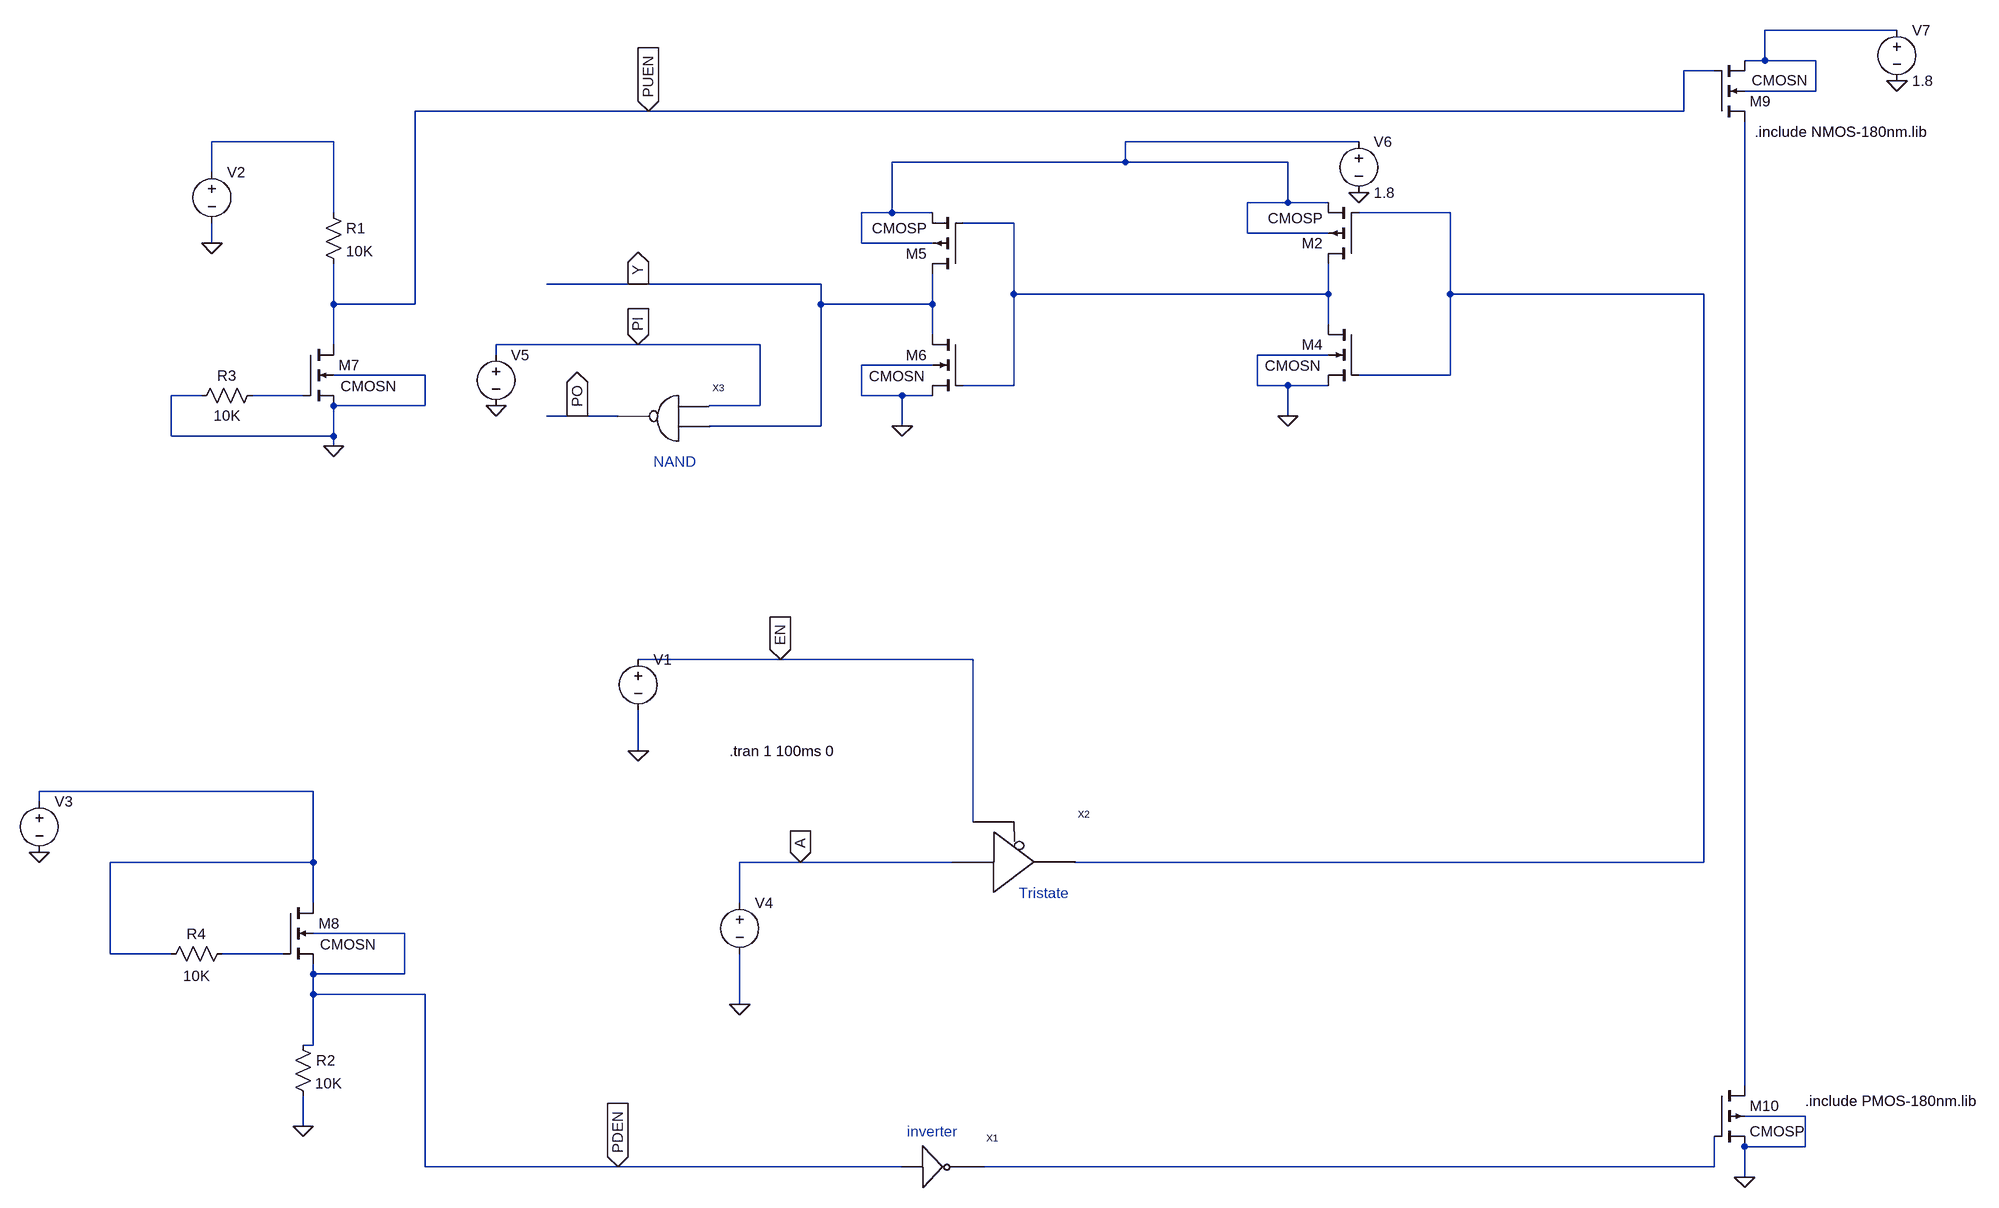
[diagram p0: schematic gpio.asc]
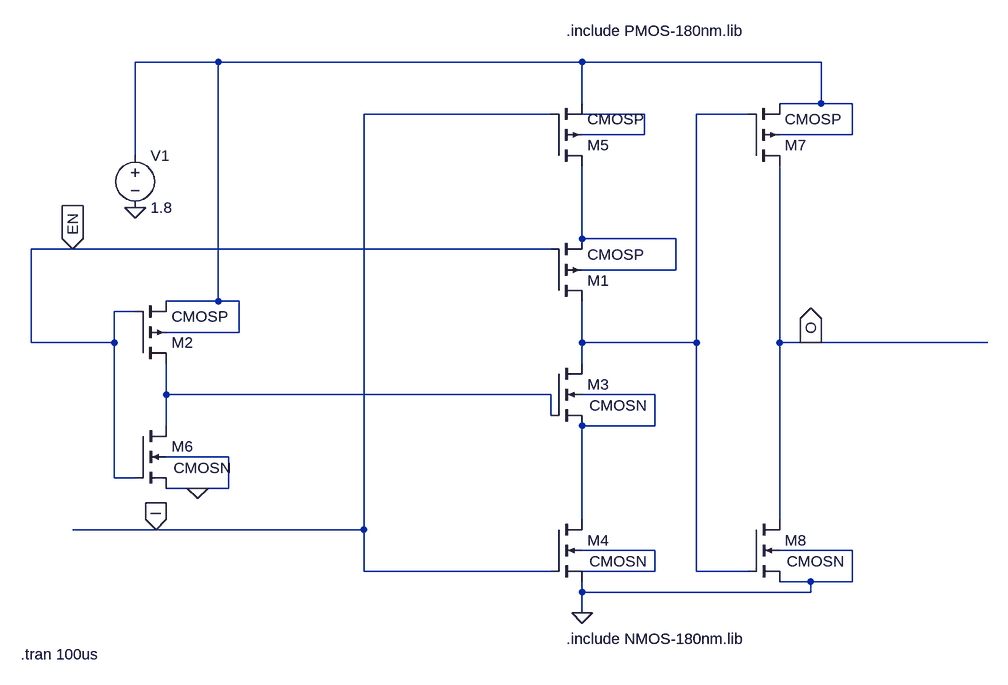
[diagram p1: sub-circuit tristate.asc]
gpio.asc, the LTspice schematic file:
Version 4
SHEET 1 3480 1104
WIRE 2240 -768 2032 -768
WIRE 2032 -720 2032 -768
WIRE 2032 -720 2000 -720
WIRE 2112 -720 2032 -720
WIRE 1952 -704 1904 -704
WIRE 2112 -672 2112 -720
WIRE 2112 -672 2000 -672
WIRE 272 -640 -96 -640
WIRE 1904 -640 1904 -704
WIRE 1904 -640 272 -640
WIRE -224 -592 -416 -592
WIRE 1392 -592 1024 -592
WIRE 1024 -560 1024 -592
WIRE 1024 -560 656 -560
WIRE 1280 -560 1024 -560
WIRE -416 -544 -416 -592
WIRE 1280 -496 1280 -560
WIRE 1280 -496 1216 -496
WIRE 1344 -496 1280 -496
WIRE -224 -480 -224 -592
WIRE 656 -480 656 -560
WIRE 656 -480 608 -480
WIRE 720 -480 656 -480
WIRE 1536 -480 1392 -480
WIRE 848 -464 768 -464
WIRE 1216 -448 1216 -496
WIRE 1344 -448 1216 -448
WIRE -416 -432 -416 -464
WIRE 608 -432 608 -480
WIRE 720 -432 608 -432
WIRE 256 -368 112 -368
WIRE 544 -368 256 -368
WIRE 848 -352 848 -464
WIRE 1344 -352 1344 -400
WIRE 1344 -352 848 -352
WIRE 1536 -352 1536 -480
WIRE 1936 -352 1536 -352
WIRE -224 -336 -224 -400
WIRE -96 -336 -96 -640
WIRE -96 -336 -224 -336
WIRE 544 -336 544 -368
WIRE 720 -336 720 -384
WIRE 720 -336 544 -336
WIRE 1344 -304 1344 -352
WIRE 720 -288 720 -336
WIRE -224 -272 -224 -336
WIRE 256 -272 32 -272
WIRE 448 -272 256 -272
WIRE 32 -256 32 -272
WIRE 1344 -256 1232 -256
WIRE 720 -240 608 -240
WIRE -80 -224 -224 -224
WIRE 1536 -224 1536 -352
WIRE 1536 -224 1392 -224
WIRE 848 -208 848 -352
WIRE 848 -208 768 -208
WIRE 1232 -208 1232 -256
WIRE 1280 -208 1232 -208
WIRE 1344 -208 1280 -208
WIRE -432 -192 -480 -192
WIRE -272 -192 -352 -192
WIRE 608 -192 608 -240
WIRE 672 -192 608 -192
WIRE 720 -192 672 -192
WIRE -80 -176 -80 -224
WIRE -80 -176 -224 -176
WIRE 448 -176 448 -272
WIRE 448 -176 368 -176
WIRE 160 -160 112 -160
WIRE 224 -160 160 -160
WIRE 1280 -160 1280 -208
WIRE 544 -144 544 -336
WIRE 544 -144 368 -144
WIRE 672 -144 672 -192
WIRE -480 -128 -480 -192
WIRE -224 -128 -224 -176
WIRE -224 -128 -480 -128
WIRE -224 -112 -224 -128
WIRE 480 224 256 224
WIRE 784 224 480 224
WIRE 256 368 256 304
WIRE -256 432 -688 432
WIRE -688 448 -688 432
WIRE 784 480 784 224
WIRE -256 544 -256 432
WIRE -256 544 -576 544
WIRE 512 544 416 544
WIRE 752 544 512 544
WIRE 1936 544 1936 -352
WIRE 1936 544 944 544
WIRE -256 608 -256 544
WIRE 416 608 416 544
WIRE -112 656 -256 656
WIRE -576 688 -576 544
WIRE -480 688 -576 688
WIRE -304 688 -400 688
WIRE -256 720 -256 704
WIRE -112 720 -112 656
WIRE -112 720 -256 720
WIRE -256 752 -256 720
WIRE -80 752 -256 752
WIRE 416 768 416 688
WIRE -256 832 -256 752
WIRE -256 832 -272 832
WIRE 2000 896 2000 -624
WIRE 2096 944 2000 944
WIRE -272 960 -272 912
WIRE 2096 992 2096 944
WIRE 2096 992 2000 992
WIRE -80 1024 -80 752
WIRE 224 1024 -80 1024
WIRE 672 1024 224 1024
WIRE 1952 1024 1952 976
WIRE 1952 1024 800 1024
WIRE 2000 1040 2000 992
FLAG 672 -144 0
FLAG 1280 -160 0
FLAG 256 368 0
FLAG -416 -432 0
FLAG -688 528 0
FLAG -272 960 0
FLAG -224 -112 0
FLAG 272 -640 PUEN
IOPIN 272 -640 In
FLAG 256 -368 Y
IOPIN 256 -368 Out
FLAG 256 -272 PI
IOPIN 256 -272 In
FLAG 480 224 EN
IOPIN 480 224 In
FLAG 416 768 0
FLAG 224 1024 PDEN
IOPIN 224 1024 In
FLAG 512 544 A
IOPIN 512 544 In
FLAG 2240 -688 0
FLAG 2000 1040 0
FLAG 160 -160 PO
IOPIN 160 -160 Out
FLAG 32 -176 0
FLAG 1392 -512 0
SYMBOL res -240 -496 R0
SYMATTR InstName R1
SYMATTR Value 10K
SYMBOL res -288 816 R0
WINDOW 3 35 76 Left 2
SYMATTR Value 10K
SYMATTR InstName R2
SYMBOL voltage 256 208 R0
WINDOW 123 0 0 Left 0
WINDOW 39 0 0 Left 0
WINDOW 3 24 44 Invisible 2
SYMATTR Value PWL(0m 1.8 9.9999m 1.8 10m 1.8 19.99990m 1.8 20m 1.8 29.9999m 1.8 30m 1.8 34.9999m 1.8 35m 1.8 39.9999m 1.8 40m 1.8 44.9999m 1.8 45m 1.8 49.9999m 1.8 50m 1.8 59.9999m 1.8 60m 1.8 69.9999m 1.8 70m 1.8 79.9999m 1.8 80m 0 89.9999m 0 90m 0 99.9999m 0)
SYMATTR InstName V1
SYMBOL voltage 416 592 R0
WINDOW 123 0 0 Left 0
WINDOW 39 0 0 Left 0
WINDOW 3 24 44 Invisible 2
SYMATTR Value PWL(0m 0 9.9999m 0 10m 1.8 19.9999m 1.8 20m 1.8 29.9999m 1.8 30m 0 34.9999m 0 35m 1.8 39.9999m 1.8 40m 0 44.9999m 0 45m 1.8 49.9999m 1.8 50m 0 59.9999m 0 60m 1.8 69.9999m 1.8 70m 1.8 79.9999m 1.8 80m 0 89.9999m 0 90m 1.8 99.9999m 1.8)
SYMATTR InstName V4
SYMBOL voltage 2240 -784 R0
WINDOW 123 0 0 Left 0
WINDOW 39 0 0 Left 0
SYMATTR InstName V7
SYMATTR Value 1.8
SYMBOL res -336 -208 R90
WINDOW 0 0 56 VBottom 2
WINDOW 3 32 56 VTop 2
SYMATTR InstName R3
SYMATTR Value 10K
SYMBOL res -384 672 R90
WINDOW 3 35 56 VTop 2
WINDOW 0 0 56 VBottom 2
SYMATTR Value 10K
SYMATTR InstName R4
SYMBOL Inverter 720 1024 R0
SYMATTR InstName X1
SYMBOL NAND 320 -160 R0
SYMATTR InstName X3
SYMBOL pmos4 768 -384 R180
SYMATTR InstName M5
SYMATTR Value CMOSP
SYMATTR Value2 l=180n w=900n m=1
SYMBOL nmos4 768 -288 M0
WINDOW 3 59 65 Left 2
SYMATTR Value CMOSN
SYMATTR InstName M6
SYMATTR Value2 l=180n w=360n
SYMBOL pmos4 1392 -400 R180
SYMATTR InstName M2
SYMATTR Value CMOSP
SYMATTR Value2 l=180n w=900n m=1
SYMBOL nmos4 1392 -304 M0
WINDOW 3 59 65 Left 2
SYMATTR Value CMOSN
SYMATTR InstName M4
SYMATTR Value2 l=180n w=360n
SYMBOL nmos4 -272 -272 R0
WINDOW 3 59 65 Left 2
SYMATTR Value CMOSN
SYMATTR InstName M7
SYMATTR Value2 l=180n w=360n
SYMBOL nmos4 -304 608 R0
WINDOW 3 59 65 Left 2
SYMATTR Value CMOSN
SYMATTR InstName M8
SYMATTR Value2 l=180n w=360n
SYMBOL nmos4 1952 -624 M180
WINDOW 3 59 65 Left 2
SYMATTR Value CMOSN
SYMATTR InstName M9
SYMATTR Value2 l=180n w=360n
SYMBOL pmos4 1952 896 R0
SYMATTR InstName M10
SYMATTR Value CMOSP
SYMATTR Value2 l=180n w=900n m=1
SYMBOL Tristate 848 528 R0
SYMATTR InstName X2
SYMBOL voltage 1392 -608 R0
WINDOW 123 0 0 Left 0
WINDOW 39 0 0 Left 0
SYMATTR InstName V6
SYMATTR Value 1.8
SYMBOL voltage -416 -560 R0
WINDOW 123 0 0 Left 0
WINDOW 39 0 0 Left 0
WINDOW 3 24 44 Invisible 2
SYMATTR Value PWL(0m 0 4.9999m 0 5m 1.8 9.9999m 1.8 10m 0 14.9999m 0 15m 1.8 19.9999m 1.8 20m 0 24.9999m 0 25m 1.8 29.9999m 1.8 30m 1.8 39.9999m 1.8 40m 1.8 49.9999m 1.8 50m 1.8 59.9999m 1.8 60m 0 69.9999m 0 70m 0 79.9999m 0)
SYMATTR InstName V2
SYMBOL voltage -688 432 R0
WINDOW 123 0 0 Left 0
WINDOW 39 0 0 Left 0
WINDOW 3 24 44 Invisible 2
SYMATTR Value PWL(0m 0 4.9999m 0 5m 1.8 9.9999m 1.8 10m 0 14.9999m 0 15m 1.8 19.9999m 1.8 20m 0 24.9999m 0 25m 1.8 29.9999m 1.8 30m 1.8 39.9999m 1.8 40m 1.8 49.9999m 1.8 50m 0 59.9999m 0 60m 1.8 69.9999m 1.8 70m 1.8 79.9999m 1.8)
SYMATTR InstName V3
SYMBOL voltage 32 -272 R0
WINDOW 3 24 44 Invisible 2
WINDOW 123 0 0 Left 0
WINDOW 39 0 0 Left 0
SYMATTR Value PWL(0m 0 4.9999m 0 5m 1.8 9.9999m 1.8 10m 0 19.9999m 0 20m 1.8 29.9999m 1.8 30m 1.8 39.9999m 1.8 40m 0 49.9999m 0 50m 0 54.9999m 0 55m 1.8 59.9999m 1.8 60m 0 69.9999m 0 70m 1.8 79.9999m 1.8)
SYMATTR InstName V5
TEXT 400 368 Left 2 !.tran 1 100ms 0
TEXT 2096 920 Left 2 !.include PMOS-180nm.lib
TEXT 2016 -608 Left 2 !.include NMOS-180nm.lib
TEXT 856 592 Left 2 ;Tristate
TEXT 680 968 Left 2 ;inverter
TEXT 280 -88 Left 2 ;NAND

tristate.asc, the sub-circuit schematic file:
Version 4
SHEET 1 2520 736
WIRE -320 -192 -448 -192
WIRE 240 -192 -320 -192
WIRE 608 -192 240 -192
WIRE 240 -128 240 -192
WIRE 608 -128 608 -192
WIRE 608 -128 544 -128
WIRE 656 -128 608 -128
WIRE 192 -112 -96 -112
WIRE 336 -112 240 -112
WIRE 496 -112 416 -112
WIRE 336 -80 336 -112
WIRE 336 -80 240 -80
WIRE 656 -80 656 -128
WIRE 656 -80 544 -80
WIRE -448 -48 -448 -192
WIRE 240 80 240 -32
WIRE 384 80 240 80
WIRE -544 96 -608 96
WIRE 192 96 -544 96
WIRE 384 128 384 80
WIRE 384 128 240 128
WIRE -320 176 -320 -192
WIRE -320 176 -400 176
WIRE -288 176 -320 176
WIRE -448 192 -480 192
WIRE -288 224 -288 176
WIRE -288 224 -400 224
WIRE -608 240 -608 96
WIRE -480 240 -480 192
WIRE -480 240 -608 240
WIRE 240 240 240 176
WIRE 416 240 416 -112
WIRE 416 240 240 240
WIRE 544 240 544 -32
WIRE 592 240 544 240
WIRE 864 240 592 240
WIRE 240 272 240 240
WIRE -400 320 -400 272
WIRE 192 320 -400 320
WIRE 352 320 240 320
WIRE 192 352 192 320
WIRE -400 368 -400 320
WIRE 352 368 352 320
WIRE 352 368 240 368
WIRE -304 416 -400 416
WIRE -480 448 -480 240
WIRE -448 448 -480 448
WIRE -352 464 -400 464
WIRE -304 464 -304 416
WIRE -304 464 -352 464
WIRE 240 512 240 368
WIRE 544 512 544 240
WIRE -416 528 -544 528
WIRE -96 528 -96 -112
WIRE -96 528 -416 528
WIRE 352 560 240 560
WIRE 656 560 544 560
WIRE -96 592 -96 528
WIRE 192 592 -96 592
WIRE 352 592 352 560
WIRE 352 592 240 592
WIRE 416 592 416 240
WIRE 496 592 416 592
WIRE 592 608 544 608
WIRE 656 608 656 560
WIRE 656 608 592 608
WIRE 240 624 240 608
WIRE 592 624 592 608
WIRE 592 624 240 624
WIRE 240 656 240 624
FLAG -448 32 0
FLAG -352 464 0
FLAG 240 656 0
FLAG -544 96 EN
IOPIN -544 96 In
FLAG -416 528 I
IOPIN -416 528 In
FLAG 592 240 O
IOPIN 592 240 Out
SYMBOL voltage -448 -64 R0
WINDOW 123 0 0 Left 0
WINDOW 39 0 0 Left 0
SYMATTR InstName V1
SYMATTR Value 1.8
SYMBOL pmos4 192 176 M180
SYMATTR InstName M1
SYMATTR Value CMOSP
SYMATTR Value2 l=180n w=900n m=1
SYMBOL pmos4 -448 272 M180
SYMATTR InstName M2
SYMATTR Value CMOSP
SYMATTR Value2 l=180n w=900n m=1
SYMBOL pmos4 192 -32 M180
SYMATTR InstName M5
SYMATTR Value CMOSP
SYMATTR Value2 l=180n w=900n m=1
SYMBOL nmos4 192 272 R0
WINDOW 3 59 65 Left 2
SYMATTR Value CMOSN
SYMATTR InstName M3
SYMATTR Value2 l=180n w=360n
SYMBOL nmos4 192 512 R0
WINDOW 3 59 65 Left 2
SYMATTR Value CMOSN
SYMATTR InstName M4
SYMATTR Value2 l=180n w=360n
SYMBOL nmos4 -448 368 R0
WINDOW 3 59 65 Left 2
SYMATTR Value CMOSN
SYMATTR InstName M6
SYMATTR Value2 l=180n w=360n
SYMBOL pmos4 496 -32 M180
SYMATTR InstName M7
SYMATTR Value CMOSP
SYMATTR Value2 l=180n w=900n m=1
SYMBOL nmos4 496 512 R0
WINDOW 3 59 65 Left 2
SYMATTR Value CMOSN
SYMATTR InstName M8
SYMATTR Value2 l=180n w=360n
TEXT 216 -240 Left 2 !.include PMOS-180nm.lib
TEXT 216 696 Left 2 !.include NMOS-180nm.lib
TEXT -624 720 Left 2 !.tran 100us

The netlist it stands for:
* gpio.asc
R1 N002 PUEN 10K
R2 PDEN 0 10K
V1 EN 0 PWL(0m 1.8 9.9999m 1.8 10m 1.8 19.99990m 1.8 20m 1.8 29.9999m 1.8 30m 1.8 34.9999m 1.8 35m 1.8 39.9999m 1.8 40m 1.8 44.9999m 1.8 45m 1.8 49.9999m 1.8 50m 1.8 59.9999m 1.8 60m 1.8 69.9999m 1.8 70m 1.8 79.9999m 1.8 80m 0 89.9999m 0 90m 0 99.9999m 0)
V4 A 0 PWL(0m 0 9.9999m 0 10m 1.8 19.9999m 1.8 20m 1.8 29.9999m 1.8 30m 0 34.9999m 0 35m 1.8 39.9999m 1.8 40m 0 44.9999m 0 45m 1.8 49.9999m 1.8 50m 0 59.9999m 0 60m 1.8 69.9999m 1.8 70m 1.8 79.9999m 1.8 80m 0 89.9999m 0 90m 1.8 99.9999m 1.8)
V7 N001 0 1.8
R3 N006 0 10K
R4 N008 N007 10K
XX1 PDEN N010 Inverter  ; pins I O
XX3 PI Y PO NAND  ; pins A B O
M5 Y N005 N003 N003 CMOSP l=180n w=900n m=1
M6 Y N005 0 0 CMOSN l=180n w=360n
M2 N005 N004 N003 N003 CMOSP l=180n w=900n m=1
M4 N005 N004 0 0 CMOSN l=180n w=360n
M7 PUEN N006 0 0 CMOSN l=180n w=360n
M8 N007 N008 PDEN PDEN CMOSN l=180n w=360n
M9 N009 PUEN N001 N001 CMOSN l=180n w=360n
M10 N009 N010 0 0 CMOSP l=180n w=900n m=1
XX2 A EN N004 tristate
V6 N003 0 1.8
V2 N002 0 PWL(0m 0 4.9999m 0 5m 1.8 9.9999m 1.8 10m 0 14.9999m 0 15m 1.8 19.9999m 1.8 20m 0 24.9999m 0 25m 1.8 29.9999m 1.8 30m 1.8 39.9999m 1.8 40m 1.8 49.9999m 1.8 50m 1.8 59.9999m 1.8 60m 0 69.9999m 0 70m 0 79.9999m 0)
V3 N007 0 PWL(0m 0 4.9999m 0 5m 1.8 9.9999m 1.8 10m 0 14.9999m 0 15m 1.8 19.9999m 1.8 20m 0 24.9999m 0 25m 1.8 29.9999m 1.8 30m 1.8 39.9999m 1.8 40m 1.8 49.9999m 1.8 50m 0 59.9999m 0 60m 1.8 69.9999m 1.8 70m 1.8 79.9999m 1.8)
V5 PI 0 PWL(0m 0 4.9999m 0 5m 1.8 9.9999m 1.8 10m 0 19.9999m 0 20m 1.8 29.9999m 1.8 30m 1.8 39.9999m 1.8 40m 0 49.9999m 0 50m 0 54.9999m 0 55m 1.8 59.9999m 1.8 60m 0 69.9999m 0 70m 1.8 79.9999m 1.8)

* block symbol definitions
.subckt tristate I EN O
V1 N001 0 1.8
M1 N003 EN N004 N004 CMOSP l=180n w=900n m=1
M2 N005 EN N001 N001 CMOSP l=180n w=900n m=1
M5 N004 I N001 N002 CMOSP l=180n w=900n m=1
M3 N003 N005 N006 N006 CMOSN l=180n w=360n
M4 N006 I 0 N007 CMOSN l=180n w=360n
M6 N005 EN 0 0 CMOSN l=180n w=360n
M7 O N003 N001 N001 CMOSP l=180n w=900n m=1
M8 O N003 0 0 CMOSN l=180n w=360n
.include PMOS-180nm.lib
.include NMOS-180nm.lib
.tran 100us
.ends tristate

.model NMOS NMOS
.model PMOS PMOS
.lib standard.mos
.tran 1 100ms 0
.include PMOS-180nm.lib
.include NMOS-180nm.lib
* Tristate
* inverter
* NAND
.backanno
.end